# EAGLE design ext512K (EAGLE 9.6.2)
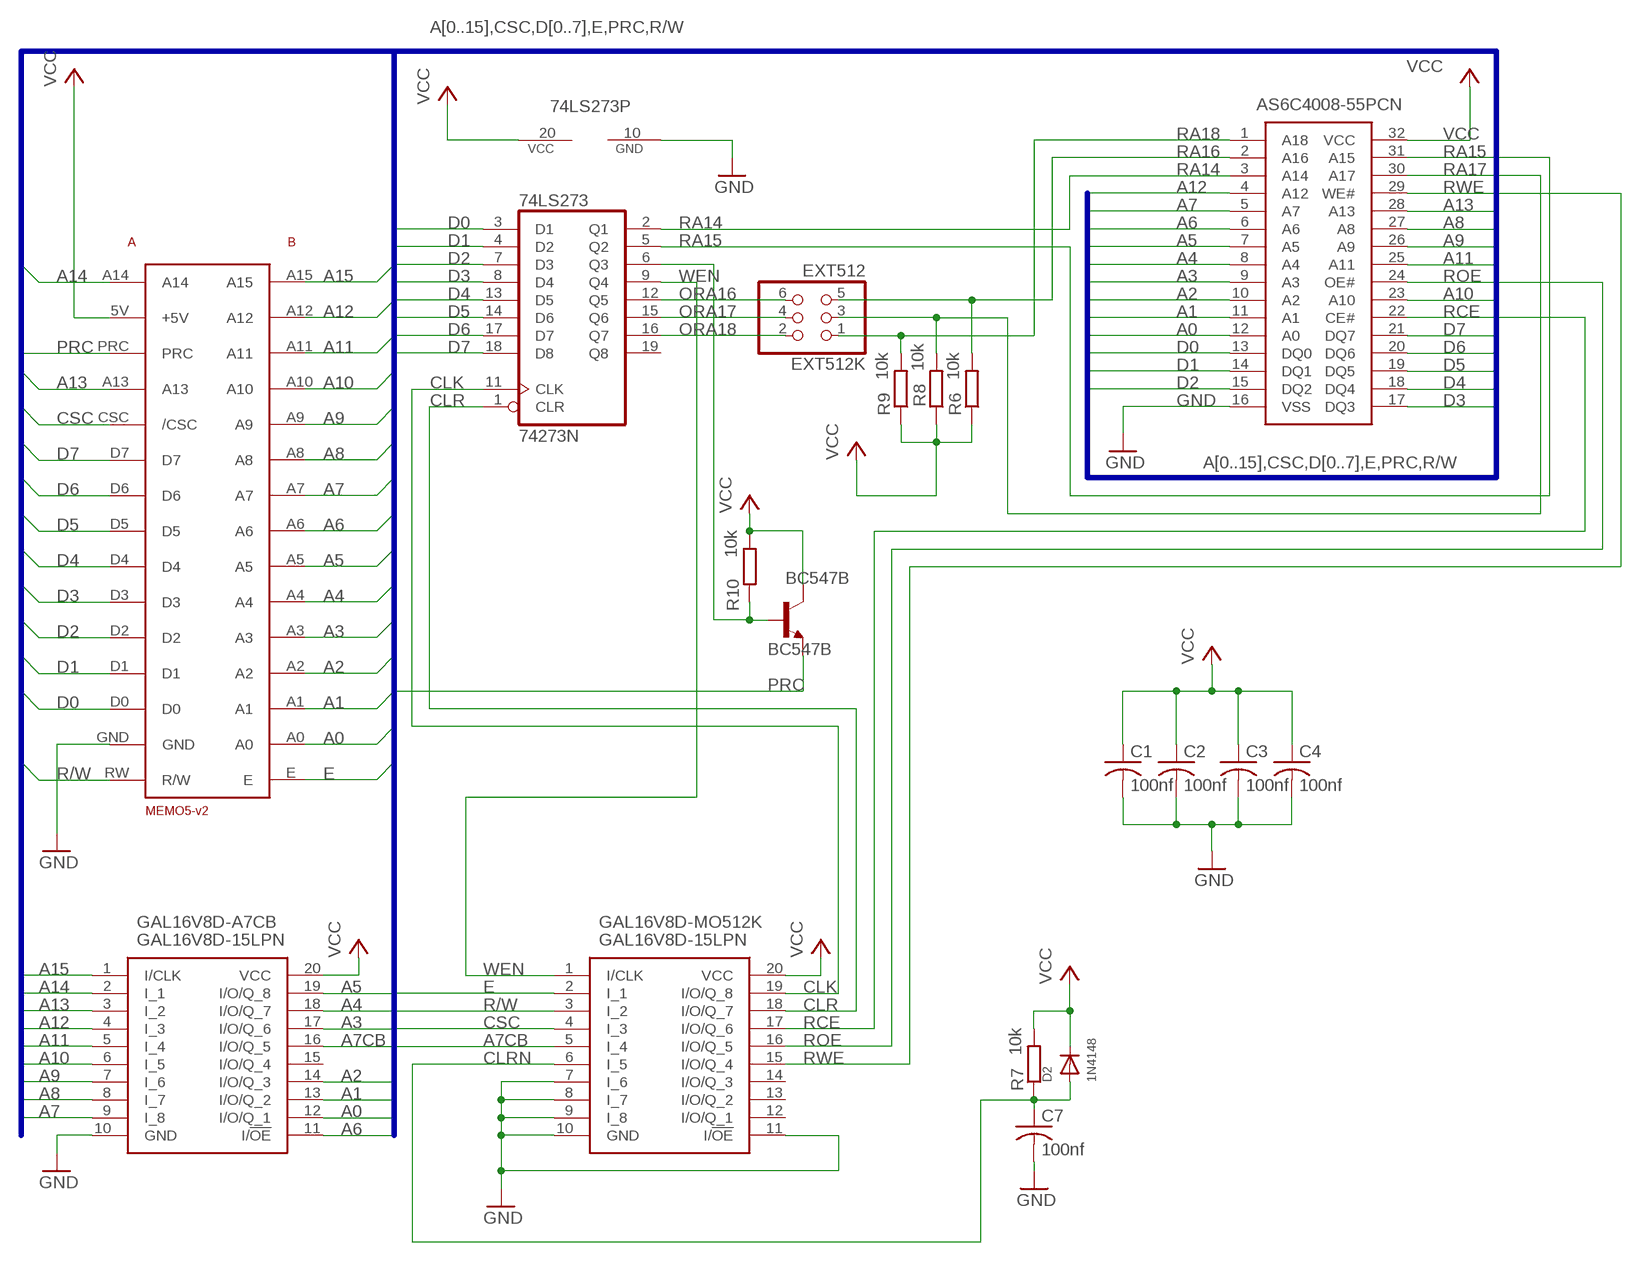
[diagram p0: schematic, sheet 1]

## Parts
74LS273  74273N  [DIL20]
AS6C4008-55PCN  AS6C4008-55PCN  [DIP1524W58P254L4191H406Q32N]
BC547B  BC547B  [TO92]
C1  100nf  C-USC1206  [C1206]
C2  100nf  C-USC1206  [C1206]
C3  100nf  C-USC1206  [C1206]
C4  100nf  C-USC1206  [C1206]
C7  100nf  C-USC1206  [C1206]
D2  1N4148  DIODEDO-1N4148  [DO-1N4148]
EXT512K  EXT512  PINHD-2X3  [2X03]
GAL16V8D-A7CB  GAL16V8D-15LPN  [DIP762W56P254L2591H533Q20N]
GAL16V8D-MO512K  GAL16V8D-15LPN  [DIP762W56P254L2591H533Q20N]
R6  10k  R-EU_R1206  [R1206]
R7  10k  R-EU_R1206  [R1206]
R8  10k  R-EU_R1206  [R1206]
R9  10k  R-EU_R1206  [R1206]
R10  10k  R-EU_R1206  [R1206]
U$1  MEMO5-V2BRD  [MEMO5-BOARD]

## Nets
A0: AS6C4008-55PCN.12(A0) GAL16V8D-A7CB.12(I/O/Q_1) U$1.A0
A1: AS6C4008-55PCN.11(A1) GAL16V8D-A7CB.13(I/O/Q_2) U$1.A1
A2: AS6C4008-55PCN.10(A2) GAL16V8D-A7CB.14(I/O/Q_3) U$1.A2
A3: AS6C4008-55PCN.9(A3) GAL16V8D-A7CB.17(I/O/Q_6) U$1.A3
A4: AS6C4008-55PCN.8(A4) GAL16V8D-A7CB.18(I/O/Q_7) U$1.A4
A5: AS6C4008-55PCN.7(A5) GAL16V8D-A7CB.19(I/O/Q_8) U$1.A5
A6: AS6C4008-55PCN.6(A6) GAL16V8D-A7CB.11(I/!OE) U$1.A6
A7: AS6C4008-55PCN.5(A7) GAL16V8D-A7CB.9(I_8) U$1.A7
A7CB: GAL16V8D-A7CB.16(I/O/Q_5) GAL16V8D-MO512K.5(I_4)
A8: AS6C4008-55PCN.27(A8) GAL16V8D-A7CB.8(I_7) U$1.A8
A9: AS6C4008-55PCN.26(A9) GAL16V8D-A7CB.7(I_6) U$1.A9
A10: AS6C4008-55PCN.23(A10) GAL16V8D-A7CB.6(I_5) U$1.A10
A11: AS6C4008-55PCN.25(A11) GAL16V8D-A7CB.5(I_4) U$1.A11
A12: AS6C4008-55PCN.4(A12) GAL16V8D-A7CB.4(I_3) U$1.A12
A13: AS6C4008-55PCN.28(A13) GAL16V8D-A7CB.3(I_2) U$1.A13
A14: GAL16V8D-A7CB.2(I_1) U$1.A14
A15: GAL16V8D-A7CB.1(I/CLK) U$1.A15
CLK: 74LS273.11(CLK) GAL16V8D-MO512K.19(I/O/Q_8)
CLR: 74LS273.1(CLR) GAL16V8D-MO512K.18(I/O/Q_7)
CLRN: C7.1 D2.A GAL16V8D-MO512K.6(I_5) R7.1
CSC: GAL16V8D-MO512K.4(I_3) U$1.CSC(/CSC)
D0: 74LS273.3(D1) AS6C4008-55PCN.13(DQ0) U$1.D0
D1: 74LS273.4(D2) AS6C4008-55PCN.14(DQ1) U$1.D1
D2: 74LS273.7(D3) AS6C4008-55PCN.15(DQ2) U$1.D2
D3: 74LS273.8(D4) AS6C4008-55PCN.17(DQ3) U$1.D3
D4: 74LS273.13(D5) AS6C4008-55PCN.18(DQ4) U$1.D4
D5: 74LS273.14(D6) AS6C4008-55PCN.19(DQ5) U$1.D5
D6: 74LS273.17(D7) AS6C4008-55PCN.20(DQ6) U$1.D6
D7: 74LS273.18(D8) AS6C4008-55PCN.21(DQ7) U$1.D7
E: GAL16V8D-MO512K.2(I_1) U$1.E
GND [pwr]: 74LS273.10(GND) AS6C4008-55PCN.16(VSS) C1.2 C2.2 C3.2 C4.2 C7.2 GAL16V8D-A7CB.10(GND) GAL16V8D-MO512K.7(I_6) GAL16V8D-MO512K.8(I_7) GAL16V8D-MO512K.9(I_8) GAL16V8D-MO512K.10(GND) GAL16V8D-MO512K.11(I/!OE) U$1.GND
N$1: 74LS273.6(Q3) BC547B.2(B) R10.1
ORA16: 74LS273.12(Q5) EXT512K.6
ORA17: 74LS273.15(Q6) EXT512K.4
ORA18: 74LS273.16(Q7) EXT512K.2
PRC: BC547B.1(E) U$1.PRC
R/W: GAL16V8D-MO512K.3(I_2) U$1.RW(R/W)
RA14: 74LS273.2(Q1) AS6C4008-55PCN.3(A14)
RA15: 74LS273.5(Q2) AS6C4008-55PCN.31(A15)
RA16: AS6C4008-55PCN.2(A16) EXT512K.5 R6.2
RA17: AS6C4008-55PCN.30(A17) EXT512K.3 R8.2
RA18: AS6C4008-55PCN.1(A18) EXT512K.1 R9.2
RCE: AS6C4008-55PCN.22(CE#) GAL16V8D-MO512K.17(I/O/Q_6)
ROE: AS6C4008-55PCN.24(OE#) GAL16V8D-MO512K.16(I/O/Q_5)
RWE: AS6C4008-55PCN.29(WE#) GAL16V8D-MO512K.15(I/O/Q_4)
VCC [pwr]: 74LS273.20(VCC) AS6C4008-55PCN.32(VCC) BC547B.3(C) C1.1 C2.1 C3.1 C4.1 D2.C GAL16V8D-A7CB.20(VCC) GAL16V8D-MO512K.20(VCC) R6.1 R7.2 R8.1 R9.1 R10.2 U$1.5V(+5V)
WEN: 74LS273.9(Q4) GAL16V8D-MO512K.1(I/CLK)
Unconnected: 74LS273.19(Q8) GAL16V8D-A7CB.15(I/O/Q_4) GAL16V8D-MO512K.12(I/O/Q_1) GAL16V8D-MO512K.13(I/O/Q_2) GAL16V8D-MO512K.14(I/O/Q_3)

## Buses
A[0..15],CSC,D[0..7],E,PRC,R/W

## Library data of the parts
74LS273 = 74xx-us:74*273: Octal D type FLIP FLOP, clear
AS6C4008-55PCN = SamacSys_Parts:AS6C4008-55PCN: CMOS SRAM Source: Datasheet <http://componentsearchengine.com/Datasheets/1/AS6C4008-55PCN.pdf>; DESCRIPTION: CMOS SRAM; HEIGHT: 4.064mm; MANUFACTURER_NAME: Alliance Memory; MANUFACTURER_PART_NUMBER: AS6C4008-55PCN; MOUSER_PART_NUMBER: 913-AS6C4008-55PCN; MOUSER_PRICE-STOCK: https://www.mouser.co.uk/ProductDetail/Alliance-Memory/AS6C4008-55PCN?qs=E5c5%252Bmu3i3%252BMOyro1Tlhzg%3D%3D
BC547B = transistor-npn:BC547*: NPN Transistor
C1-C4 C7 = resistor:C-US: CAPACITOR, American symbol
D2 = adafruit:DIODE: Diode SMADIODE - SMA Surface Mount Package 20V 1A Schottky Diode Digikey: 641-1014-6-ND DO-1N4148 - Through Hole Small Current Diode SOD-123 20V 1 A (.5mV Vf) Schottky Diode - Digikey: MBRX120TPMSCT-ND SOD-323 10V 570mA (.38mV Vf, 3ns) Schottky Diode - Digikey: ZLLS410CT-ND SOD-523 30V 30mA Schottky Diode (RB751S-40TE61) - Digikey: RB751S-40TE61CT-ND SOT23-R/W - SOT23 Package (R = Solder Paste/Reflow Ovens, W = Hand-Soldering) BAT54Film 40V 300mA - Digikey: 497-7162-1-ND
EXT512K = pinhead:PINHD-2X3: PIN HEADER
GAL16V8D-A7CB GAL16V8D-MO512K = SamacSys_Parts:GAL16V8D-15LPN: IC CPLD 8MC 15NS 20DIP Source: Datasheet <http://uk.rs-online.com/web/p/products/6250071>; DESCRIPTION: IC CPLD 8MC 15NS 20DIP; HEIGHT: 5.334mm; MANUFACTURER_NAME: Lattice Semiconductor; MANUFACTURER_PART_NUMBER: GAL16V8D-15LPN; MOUSER_PART_NUMBER: 842-GAL16V8D15LPN; MOUSER_PRICE-STOCK: https://www.mouser.co.uk/ProductDetail/Lattice/GAL16V8D-15LPN/?qs=SKRcP3y%252BHgMoZwlrwJ0h8g%3D%3D
R6-R10 = resistor:R-EU_: RESISTOR, European symbol
U$1 = custom-chips:MEMO5-V2

## Net classes
0 default: width 0.152 mm, drill 0.152 mm, clearance 0.152 mm
1 pwr: width 0.305 mm, drill 0.305 mm, clearance 0.305 mm

## Board
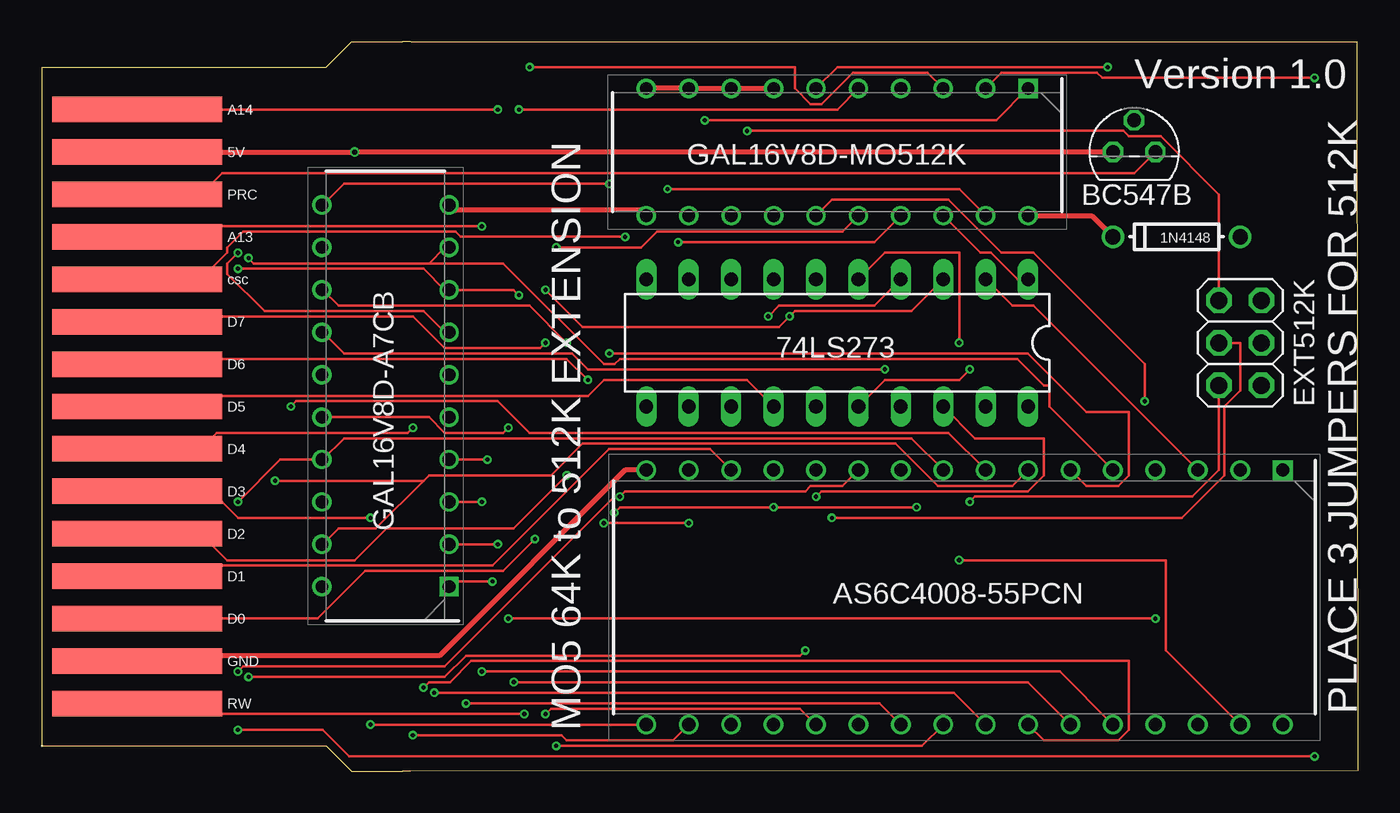
[diagram p1: board, top side]
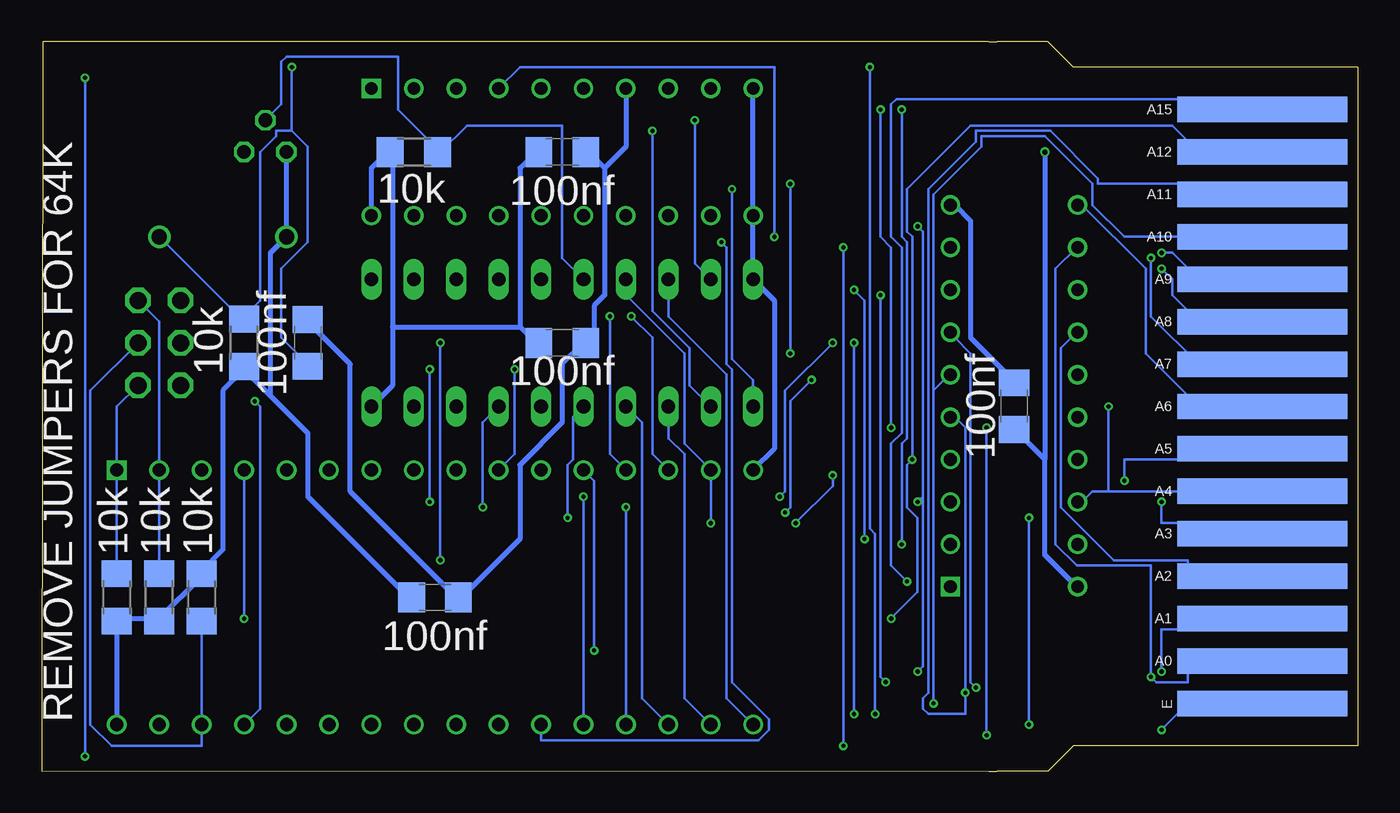
[diagram p2: board, bottom side, seen from below]

Size 78.79 x 43.69 mm. Coordinates in mm from the lower left corner, seen from the top.
Outline: 22.12,43.69 78.74,43.69 78.79,0.03 22.1,0 21.59,0
Outline: 22.1,43.69 21.59,43.69
Copper layers (1*16): Top 0.035559375mm / dielectric 1.6mm / Bottom 0.035559375mm
Design rules "oshpark-2layer": minimum track width 6mil, minimum drill 10mil, track to track 6mil, track to pad 6mil, pad to pad 6mil, via to via 6mil, smd to smd 6mil, copper to edge 15mil, drill to drill 6mil, minimum pad ring 5mil, minimum via ring 5mil, stop-mask expansion 2.5mil, vias tented up to drill 0mil, thermal gap 10mil
vRestrict: area 9.5,1.5 to 11.4,42.2; area 15.2,9.8 to 18.4,35.2; area 22.9,9.8 to 26,35.2; area 34.9,39.6 to 60.3,42.2; area 35.6,32 to 60.3,34.5; area 34.9,27.6 to 60.3,31.4; area 34.9,19.9 to 60.3,23.7; area 34.9,16.8 to 75.6,19.9; area 34.9,1.5 to 75.6,4.1; area 67.3,6.6 to 76.2,13.6; area 52.1,8.5 to 58.4,12.3; area 61.6,22.5 to 68.6,28.8; area 68.6,21.2 to 74.9,30.1; area 62.9,35.2 to 67.9,40.9

### Footprints (pad centres in the part's own frame; a part is rotated, then mirrored left to right if it is on the bottom)
DIL20 = drill 0.813 long: 1 -11.43,-3.81; 2 -8.89,-3.81; 3 -6.35,-3.81; 4 -3.81,-3.81; 5 -1.27,-3.81; 6 1.27,-3.81; 7 3.81,-3.81; 8 6.35,-3.81; 9 8.89,-3.81; 10 11.43,-3.81; 11 11.43,3.81; 12 8.89,3.81; 13 6.35,3.81; 14 3.81,3.81; 15 1.27,3.81; 16 -1.27,3.81; 17 -3.81,3.81; 18 -6.35,3.81; 19 -8.89,3.81; 20 -11.43,3.81
DIP1524W58P254L4191H406Q32N = drill 0.784 pad 1.184 square: 1 -7.62,19.05 | drill 0.784 pad 1.184: 2 -7.62,16.51; 3 -7.62,13.97; 4 -7.62,11.43; 5 -7.62,8.89; 6 -7.62,6.35; 7 -7.62,3.81; 8 -7.62,1.27; 9 -7.62,-1.27; 10 -7.62,-3.81; 11 -7.62,-6.35; 12 -7.62,-8.89; 13 -7.62,-11.43; 14 -7.62,-13.97; 15 -7.62,-16.51; 16 -7.62,-19.05; 17 7.62,-19.05; 18 7.62,-16.51; 19 7.62,-13.97; 20 7.62,-11.43; 21 7.62,-8.89; 22 7.62,-6.35; 23 7.62,-3.81; 24 7.62,-1.27; 25 7.62,1.27; 26 7.62,3.81; 27 7.62,6.35; 28 7.62,8.89; 29 7.62,11.43; 30 7.62,13.97; 31 7.62,16.51; 32 7.62,19.05
TO92 = drill 0.813 octagon: 1 1.27,0; 2 0,1.905; 3 -1.27,0
C1206 = smd 1.6 x 1.8: 1 -1.4,0; 2 1.4,0
DO-1N4148 = drill 0.9: A -3.81,0; C 3.81,0
2X03 = drill 1.016 octagon: 1 -2.54,-1.27; 2 -2.54,1.27; 3 0,-1.27; 4 0,1.27; 5 2.54,-1.27; 6 2.54,1.27
DIP762W56P254L2591H533Q20N = drill 0.759 pad 1.159 square: 1 -3.81,11.43 | drill 0.759 pad 1.159: 2 -3.81,8.89; 3 -3.81,6.35; 4 -3.81,3.81; 5 -3.81,1.27; 6 -3.81,-1.27; 7 -3.81,-3.81; 8 -3.81,-6.35; 9 -3.81,-8.89; 10 -3.81,-11.43; 11 3.81,-11.43; 12 3.81,-8.89; 13 3.81,-6.35; 14 3.81,-3.81; 15 3.81,-1.27; 16 3.81,1.27; 17 3.81,3.81; 18 3.81,6.35; 19 3.81,8.89; 20 3.81,11.43
R1206 = smd 1.6 x 1.803: 1 -1.422,0; 2 1.422,0
MEMO5-BOARD = smd 1.524 x 10.16: 5V -12.7,5.715; A13 -7.62,5.715; A14 -15.24,5.715; CSC -5.08,5.715; D0 15.24,5.715; D1 12.7,5.715; D2 10.16,5.715; D3 7.62,5.715; D4 5.08,5.715; D5 2.54,5.715; D6 0,5.715; D7 -2.54,5.715; GND 17.78,5.715; PRC -10.16,5.715; RW 20.32,5.715 | smd 1.524 x 10.16 bottom: A0 17.78,5.715; A1 15.24,5.715; A2 12.7,5.715; A3 10.16,5.715; A4 7.62,5.715; A5 5.08,5.715; A6 2.54,5.715; A7 0,5.715; A8 -2.54,5.715; A9 -5.08,5.715; A10 -7.62,5.715; A11 -10.16,5.715; A12 -12.7,5.715; A15 -15.24,5.715; E 20.32,5.715

### Placement (x,y rotation side)
74LS273  47.62,25.65 180 top
AS6C4008-55PCN  55.24,10.41 270 top
BC547B  65.41,37.08 0 top
C1  47.62,37.08 0 bottom
C2  55.24,10.41 0 bottom
C3  20.57,21.87 90 bottom
C4  47.62,25.65 0 bottom
C7  62.87,25.65 90 bottom
D2  67.94,32 180 top
EXT512K  71.75,25.65 90 top
GAL16V8D-A7CB  20.57,22.48 180 top
GAL16V8D-MO512K  47.62,37.08 270 top
R6  71.75,10.41 90 bottom
R7  66.67,25.65 270 bottom
R8  69.22,10.41 270 bottom
R9  74.3,10.41 90 bottom
R10  56.52,37.08 180 bottom
U$1  0,24.38 270 top

### Tracks (layer width: path | path; a pad name or v marks a point on that pad's centre or on a via)
A0  (via drill 0.25)
  Top 0.152: v45.72,7.24 45.4,6.92 25.4,6.92 24.13,5.65 v12.38,5.65
  Bottom 0.152: U$1.A0 9.53,6.6 10.16,5.97 10.16,5.33 12.06,5.33 v12.38,5.65 12.38,12.32 16.83,12.32 18.1,13.59 18.1,30.1 16.83,31.37 GAL16V8D-A7CB.12 | AS6C4008-55PCN.12 45.72,17.4 v45.72,7.24
A1  (via drill 0.25)
  Top 0.152: v31.43,25.65 29.21,27.88 17.78,27.88 16.83,28.83 GAL16V8D-A7CB.13 | AS6C4008-55PCN.11 47.94,17.08 46.04,17.08 45.72,16.76 34.92,16.76 v34.61,16.45 34.29,16.45 24.13,6.29 12.06,6.29 v11.75,5.97
  Bottom 0.152: v31.43,25.65 34.29,22.8 34.29,16.76 v34.61,16.45 | U$1.A1 6.35,8.51 11.75,8.51 v11.75,5.97
A2  (via drill 0.25)
  Top 0.152: v50.48,24.07 32.7,24.07 31.75,25.02 18.1,25.02 16.83,26.29 GAL16V8D-A7CB.14
  Bottom 0.152: U$1.A2 9.53,11.68 10.16,12.32 10.16,12.64 14.61,12.64 17.78,15.81 17.78,25.34 16.83,26.29 GAL16V8D-A7CB.14 | AS6C4008-55PCN.10 50.48,18.99 v50.48,24.07
A3  (via drill 0.25)
  Top 0.152: AS6C4008-55PCN.9 52.07,19.94 18.1,19.94 16.83,18.67 GAL16V8D-A7CB.17 14.29,18.67 v11.75,16.13
  Bottom 0.152: U$1.A3 6.35,14.86 11.75,14.86 v11.75,16.13
A4  (via drill 0.25)
  Top 0.152: AS6C4008-55PCN.8 54.29,20.26 29.21,20.26 27.3,22.16 15.24,22.16 v14.92,21.84
  Bottom 0.152: U$1.A4 14.92,16.76 | 14.92,16.76 15.88,16.76 16.51,16.13 GAL16V8D-A7CB.18 | 14.92,16.76 v14.92,21.84
A5  (via drill 0.25)
  Top 0.152: 22.86,17.4 23.18,17.72 30.48,17.72 32.38,19.62 51.12,19.62 53.66,17.08 58.1,17.08 AS6C4008-55PCN.7 | 22.86,17.4 20,14.54 17.78,14.54 16.83,13.59 GAL16V8D-A7CB.19 | 22.86,17.4 v13.97,17.4
  Bottom 0.152: U$1.A5 6.35,18.67 13.97,18.67 v13.97,17.4
A6  (via drill 0.25)
  Top 0.152: AS6C4008-55PCN.6 62.55,17.08 64.45,17.08 65.09,17.72 65.09,21.53 62.55,21.53 59.05,25.02 v33.97,25.02 | v33.97,35.18 18.1,35.18 16.83,33.91 GAL16V8D-A7CB.11
  Bottom 0.152: U$1.A6 9.53,21.84 12.7,25.02 12.7,30.1 16.51,33.91 GAL16V8D-A7CB.11 | v33.97,35.18 v33.97,25.02
A7  (via drill 0.25)
  Top 0.152: 23.18,30.42 24.13,31.37 GAL16V8D-A7CB.9 | 23.18,30.42 12.7,30.42 v12.38,30.73 | AS6C4008-55PCN.5 60.33,21.84 60.33,23.11 60.01,23.11 58.42,24.7 34.61,24.7 34.29,24.38 33.66,24.38 27.62,30.42 23.18,30.42
  Bottom 0.152: v12.38,30.73 12.38,27.24 9.53,24.38 U$1.A7
A7CB  (via drill 0.25)
  Top 0.152: GAL16V8D-A7CB.16 23.18,21.21 24.13,20.26 27.62,20.26 v27.94,20.57 | v28.57,39.62 47.62,39.62 GAL16V8D-MO512K.5
  Bottom 0.152: v27.94,20.57 27.94,31.37 28.57,32 v28.57,39.62
A8  (via drill 0.25)
  Top 0.152: v11.75,30.1 22.86,30.1 24.13,28.83 GAL16V8D-A7CB.8 28.26,28.83 v28.57,28.51 | AS6C4008-55PCN.27 59.05,5.33 v28.26,5.33
  Bottom 0.152: v11.75,30.1 11.11,29.46 11.11,28.51 9.53,26.92 U$1.A8 | v28.26,5.33 28.57,5.65 v28.57,28.51
A9  (via drill 0.25)
  Top 0.152: v11.75,31.05 11.11,30.42 11.11,29.78 13.34,27.56 22.86,27.56 24.13,26.29 GAL16V8D-A7CB.7 | AS6C4008-55PCN.26 60.01,1.84 64.45,1.84 65.09,2.48 65.09,6.6 25.72,6.6 24.45,5.33 23.18,5.33 v22.86,5.02
  Bottom 0.152: v11.75,31.05 11.11,31.05 9.53,29.46 U$1.A9 | v22.86,5.02 23.18,5.33 23.18,25.02 24.13,25.97 24.13,26.29 GAL16V8D-A7CB.7
A10  (via drill 0.25)
  Top 0.152: v25.4,4.06 50.16,4.06 AS6C4008-55PCN.23
  Bottom 0.152: 25.4,22.8 24.45,23.75 GAL16V8D-A7CB.6 | v25.4,4.06 25.4,22.8 | U$1.A10 13.97,32 15.88,33.91 15.88,35.18 18.73,38.04 22.54,38.04 22.54,37.4 25.4,34.54 25.4,22.8
A11  (via drill 0.25)
  Top 0.152: v23.5,4.7 54.61,4.7 AS6C4008-55PCN.25
  Bottom 0.152: GAL16V8D-A7CB.5 24.13,21.21 23.5,20.57 v23.5,4.7 23.5,3.43 25.72,3.43 26.04,3.75 26.04,4.38 25.72,4.7 25.72,34.86 22.86,37.72 22.86,38.35 18.41,38.35 15.56,35.5 15.56,35.18 6.35,35.18 U$1.A11
A12  (via drill 0.25)
  Top 0.152: v26.67,18.67 GAL16V8D-A7CB.4 | v27.94,9.14 v66.67,9.14
  Bottom 0.152: U$1.A12 9.53,37.08 11.11,38.67 23.18,38.67 26.99,34.86 26.99,32.32 26.67,32 v26.67,18.67 26.99,18.35 26.99,15.81 26.35,15.18 26.35,10.73 v27.94,9.14 | v66.67,9.14 AS6C4008-55PCN.4
A13  (via drill 0.25)
  Top 0.152: v26.35,16.13 GAL16V8D-A7CB.3 | v26.35,32.64 6.35,32.64 U$1.A13 | AS6C4008-55PCN.28 60.96,5.97 v26.35,5.97
  Bottom 0.152: 26.04,16.45 v26.35,16.13 | 26.04,16.45 26.04,32.32 v26.35,32.64 | v26.35,5.97 26.04,6.29 26.04,16.45
A14  (via drill 0.25)
  Top 0.152: v27.3,13.59 GAL16V8D-A7CB.2 | U$1.A14 v27.3,39.62
  Bottom 0.152: v27.3,13.59 27.3,19.62 26.99,19.94 26.99,31.69 27.3,32 v27.3,39.62
A15  (via drill 0.25)
  Top 0.152: v26.99,11.37 24.77,11.37 24.45,11.05 GAL16V8D-A7CB.1
  Bottom 0.152: v26.99,11.37 27.94,12.32 27.94,19.62 27.3,20.26 27.3,31.37 27.94,32 27.94,39.94 27.62,40.26 5.71,40.26 U$1.A15
CLK  (via drill 0.25)
  Top 0.152: GAL16V8D-MO512K.19 54.93,34.86 v37.47,34.86
  Bottom 0.152: v37.47,34.86 37.47,24.7 36.2,23.43 74LS273.11
CLR
  Top 0.152: GAL16V8D-MO512K.18 56.2,31.05 56.83,31.05 58.42,29.46 74LS273.1
CLRN  (via drill 0.25)
  Top 0.152: GAL16V8D-MO512K.6 47.62,42.16 v63.82,42.16
  Bottom 0.152: 63.82,38.35 62.87,37.4 62.87,31.69 64.45,30.1 64.45,25.97 62.87,24.38 C7.1 | 63.82,38.35 64.77,38.35 64.77,38.04 65.72,37.08 65.72,28.19 66.67,27.24 R7.1 66.67,26.92 D2.A | 63.82,38.35 v63.82,42.16
CSC  (via drill 0.25)
  Top 0.152: v34.92,32 25.08,32 24.77,32.32 12.06,32.32 11.11,31.37 11.11,31.05 9.53,29.46 U$1.CSC
  Bottom 0.152: GAL16V8D-MO512K.4 50.16,42.16 34.92,42.16 v34.92,32
D0  (via drill 0.25)
  Top 0.152: 74LS273.3 52.07,27.56 45.09,27.56 v44.77,27.24 44.13,26.61 32.38,26.61 v30.16,28.83 | v29.53,13.91 27.62,12 19.37,12 16.51,9.14 U$1.D0
  Bottom 0.152: AS6C4008-55PCN.13 44.77,18.99 v44.77,27.24 | v30.16,28.83 29.53,28.19 v29.53,13.91
D1  (via drill 0.25)
  Top 0.152: AS6C4008-55PCN.14 40.01,19.3 33.97,19.3 26.99,12.32 6.35,12.32 U$1.D1 | 74LS273.4 49.85,27.88 44.13,27.88 v43.5,27.24
  Bottom 0.152: v43.5,27.24 42.23,25.97 42.23,18.99 AS6C4008-55PCN.14
D2  (via drill 0.25)
  Top 0.152: v33.66,14.86 v38.73,14.86 | v31.43,17.72 28.26,14.54 20.64,14.54 18.73,12.64 11.11,12.64 9.53,14.22 U$1.D2
  Bottom 0.152: 74LS273.7 43.81,28.51 40.32,25.02 40.32,19.62 AS6C4008-55PCN.15 v38.73,14.86 | v33.66,14.86 31.43,17.08 v31.43,17.72
D3  (via drill 0.25)
  Top 0.152: U$1.D3 6.35,16.13 10.79,16.13 11.75,15.18 v19.68,15.18 | AS6C4008-55PCN.17 v19.68,2.79
  Bottom 0.152: AS6C4008-55PCN.17 37.78,4.38 37.78,23.75 41.27,27.24 74LS273.8 | v19.68,2.79 v19.68,15.18
D4  (via drill 0.25)
  Top 0.152: AS6C4008-55PCN.18 37.78,1.84 31.43,1.84 31.11,2.16 v22.23,2.16 | v22.23,20.57 21.91,20.26 10.48,20.26 9.53,19.3 U$1.D4
  Bottom 0.152: AS6C4008-55PCN.18 40.32,4.38 40.32,18.99 41.27,19.94 74LS273.13 | v22.23,20.57 v22.23,2.16
D5
  Top 0.152: 74LS273.14 42.23,23.43 33.66,23.43 32.7,22.48 6.35,22.48 U$1.D5
  Bottom 0.152: AS6C4008-55PCN.19 42.86,4.38 42.86,20.89 74LS273.14
D6  (via drill 0.25)
  Top 0.152: v52.39,15.81 v43.81,15.81 34.61,15.81 v34.29,15.49 | U$1.D6 6.03,24.7 31.43,24.7 v32.7,23.43
  Bottom 0.152: v43.81,15.81 AS6C4008-55PCN.20 | v52.39,15.81 52.39,20.89 74LS273.17 | v32.7,23.43 33.97,22.16 33.97,15.81 v34.29,15.49
D7  (via drill 0.25)
  Top 0.152: v46.35,16.45 46.67,16.76 59.05,16.76 60.01,17.72 60.01,19.94 55.88,19.94 74LS273.18 | U$1.D7 6.03,27.24 22.23,27.24 24.13,25.34 29.84,25.34 v30.16,25.65 | v30.16,3.43 30.48,3.75 45.4,3.75 AS6C4008-55PCN.21
  Bottom 0.152: v46.35,16.45 AS6C4008-55PCN.21 | v30.16,3.43 v30.16,25.65
E  (via drill 0.25)
  Top 0.152: GAL16V8D-MO512K.2 57.47,41.85 63.18,41.85 63.5,41.53 v76.2,41.53 | v76.2,0.89 18.41,0.89 16.83,2.48 v11.75,2.48
  Bottom 0.152: v76.2,0.89 v76.2,41.53 | v11.75,2.48 10.16,4.06 U$1.E
GND
  Top 0.305: GAL16V8D-MO512K.10 GAL16V8D-MO512K.9 GAL16V8D-MO512K.8 GAL16V8D-MO512K.7 | GAL16V8D-MO512K.11 35.88,33.59 24.77,33.59 24.45,33.91 GAL16V8D-A7CB.10 | U$1.GND 6.03,6.92 23.81,6.92 34.92,18.03 AS6C4008-55PCN.16
  Bottom 0.305: 45.09,36.13 45.09,28.51 45.72,27.88 45.72,25.97 46.04,25.65 C4.2 46.35,25.65 47.62,24.38 47.62,20.89 50.16,18.35 50.16,13.91 53.66,10.41 C2.2 53.98,10.41 60.33,16.76 60.33,24.38 62.87,26.92 C7.2 | 45.09,36.13 46.04,37.08 C1.2 | C3.2 20.64,23.43 23.18,25.97 23.18,32.96 24.13,33.91 GAL16V8D-A7CB.10 | AS6C4008-55PCN.16 34.92,19.3 34.92,28.19 74LS273.10 GAL16V8D-MO512K.11 GAL16V8D-MO512K.10 | 45.09,36.13 43.81,37.4 GAL16V8D-MO512K.7
N$1
  Bottom 0.152: 74LS273.6 47.62,30.73 47.62,38.67 53.34,38.67 54.93,37.08 R10.1 55.24,37.08 55.24,37.4 57.47,39.62 57.47,42.8 64.14,42.8 64.45,42.48 64.45,39.94 BC547B.2
ORA16  (via drill 0.25)
  Top 0.152: v42.23,38.35 64.77,38.35 65.09,38.04 66.99,38.04 70.48,34.54 EXT512K.6
  Bottom 0.152: 74LS273.12 40.01,23.11 40.01,25.34 42.23,27.56 v42.23,38.35
ORA17  (via drill 0.25)
  Top 0.152: v47.31,15.18 68.26,15.18 70.8,17.72 70.8,21.84 71.75,22.8 71.75,25.65 EXT512K.4
  Bottom 0.152: 74LS273.15 46.99,21.21 46.99,18.67 47.31,18.35 v47.31,15.18
ORA18  (via drill 0.25)
  Top 0.152: 74LS273.16 50.48,23.43 54.93,23.43 v55.56,24.07 | v55.56,16.13 55.88,16.45 68.9,16.45 70.48,18.03 EXT512K.2
  Bottom 0.152: v55.56,16.13 v55.56,24.07
PRC
  Top 0.152: BC547B.1 65.41,35.81 10.79,35.81 9.53,34.54 U$1.PRC
R/W  (via drill 0.25)
  Top 0.152: GAL16V8D-MO512K.3 53.02,41.85 48.58,41.85 46.67,39.94 46.04,39.94 45.09,40.89 45.09,42.16 v29.21,42.16 | v28.89,3.43 6.35,3.43 U$1.RW
  Bottom 0.152: v29.21,42.16 29.21,14.54 28.89,14.22 v28.89,3.43
RA14
  Top 0.152: AS6C4008-55PCN.3 59.37,27.88 58.1,27.88 74LS273.2
RA15  (via drill 0.25)
  Top 0.152: AS6C4008-55PCN.31 67.31,7.24 67.31,12.64 v54.93,12.64 | v54.93,25.65 54.93,31.05 50.48,31.05 74LS273.5
  Bottom 0.152: v54.93,25.65 v54.93,12.64
RA16
  Bottom 0.152: R6.2 AS6C4008-55PCN.2 71.75,26.92 EXT512K.5
RA17
  Bottom 0.152: R8.2 AS6C4008-55PCN.30 69.22,1.52 74.61,1.52 75.88,2.79 75.88,22.8 EXT512K.3
RA18
  Bottom 0.152: R9.2 AS6C4008-55PCN.1 74.3,21.84 EXT512K.1
RCE  (via drill 0.25)
  Top 0.152: GAL16V8D-MO512K.17 49.85,31.69 v38.1,31.69
  Bottom 0.152: v38.1,31.69 37.78,31.37 37.78,24.38 37.47,24.07 37.47,5.33 35.24,3.11 35.24,2.48 35.88,1.84 48.9,1.84 AS6C4008-55PCN.22
ROE  (via drill 0.25)
  Top 0.152: GAL16V8D-MO512K.16 47.94,32.32 36.83,32.32 35.88,31.37 v30.8,31.37 | v30.8,1.52 52.7,1.52 AS6C4008-55PCN.24
  Bottom 0.152: v30.8,1.52 v30.8,31.37
RWE  (via drill 0.25)
  Top 0.152: GAL16V8D-MO512K.15 47.31,34.23 54.29,34.23 57.47,31.05 59.37,31.05 66.04,24.38 v66.04,22.16
  Bottom 0.152: v66.04,22.16 65.72,21.84 65.72,3.75 AS6C4008-55PCN.29
VCC  (via drill 0.3)
  Top 0.305: U$1.5V v18.73,37.08 BC547B.3 | D2.C 62.87,33.27 GAL16V8D-MO512K.20
  Bottom 0.305: 18.73,18.67 20.32,20.26 C3.1 | 18.73,18.67 18.73,12.95 16.83,11.05 GAL16V8D-A7CB.20 | v18.73,37.08 18.73,18.67 | 50.16,26.61 49.21,25.65 C4.1 | 50.16,26.61 50.16,36.13 49.21,37.08 C1.1 | BC547B.3 D2.C 65.09,31.05 65.09,22.48 | GAL16V8D-MO512K.20 59.05,36.13 58.1,37.08 R10.2 57.78,37.08 57.78,26.61 | 74LS273.20 57.78,23.11 57.78,26.61 | 57.78,26.61 50.16,26.61 | 71.75,9.14 74.3,9.14 R9.1 AS6C4008-55PCN.32 | 71.75,9.14 69.22,11.68 R8.1 69.22,12 67.94,13.27 67.94,22.8 66.67,24.07 | 71.75,9.14 R6.1 | 66.67,24.07 65.09,22.48 | 65.09,22.48 62.87,20.26 62.87,16.45 56.83,10.41 C2.1 | 66.67,24.07 R7.2
WEN  (via drill 0.25)
  Top 0.152: GAL16V8D-MO512K.1 57.15,38.99 v39.69,38.99
  Bottom 0.152: v39.69,38.99 39.69,30.42 74LS273.9

### Text on the board
tPlace: Version 1.0 | MO5 64K to 512K EXTENSION | PLACE 3 JUMPERS FOR 512K
bPlace: REMOVE JUMPERS FOR 64K | 10k | 100nf | 100nf | 10k | 100nf | 100nf | 10k | 10k | 10k | 100nf